# Altium schematic sheet G-103M-20190827.SchDoc
size A3
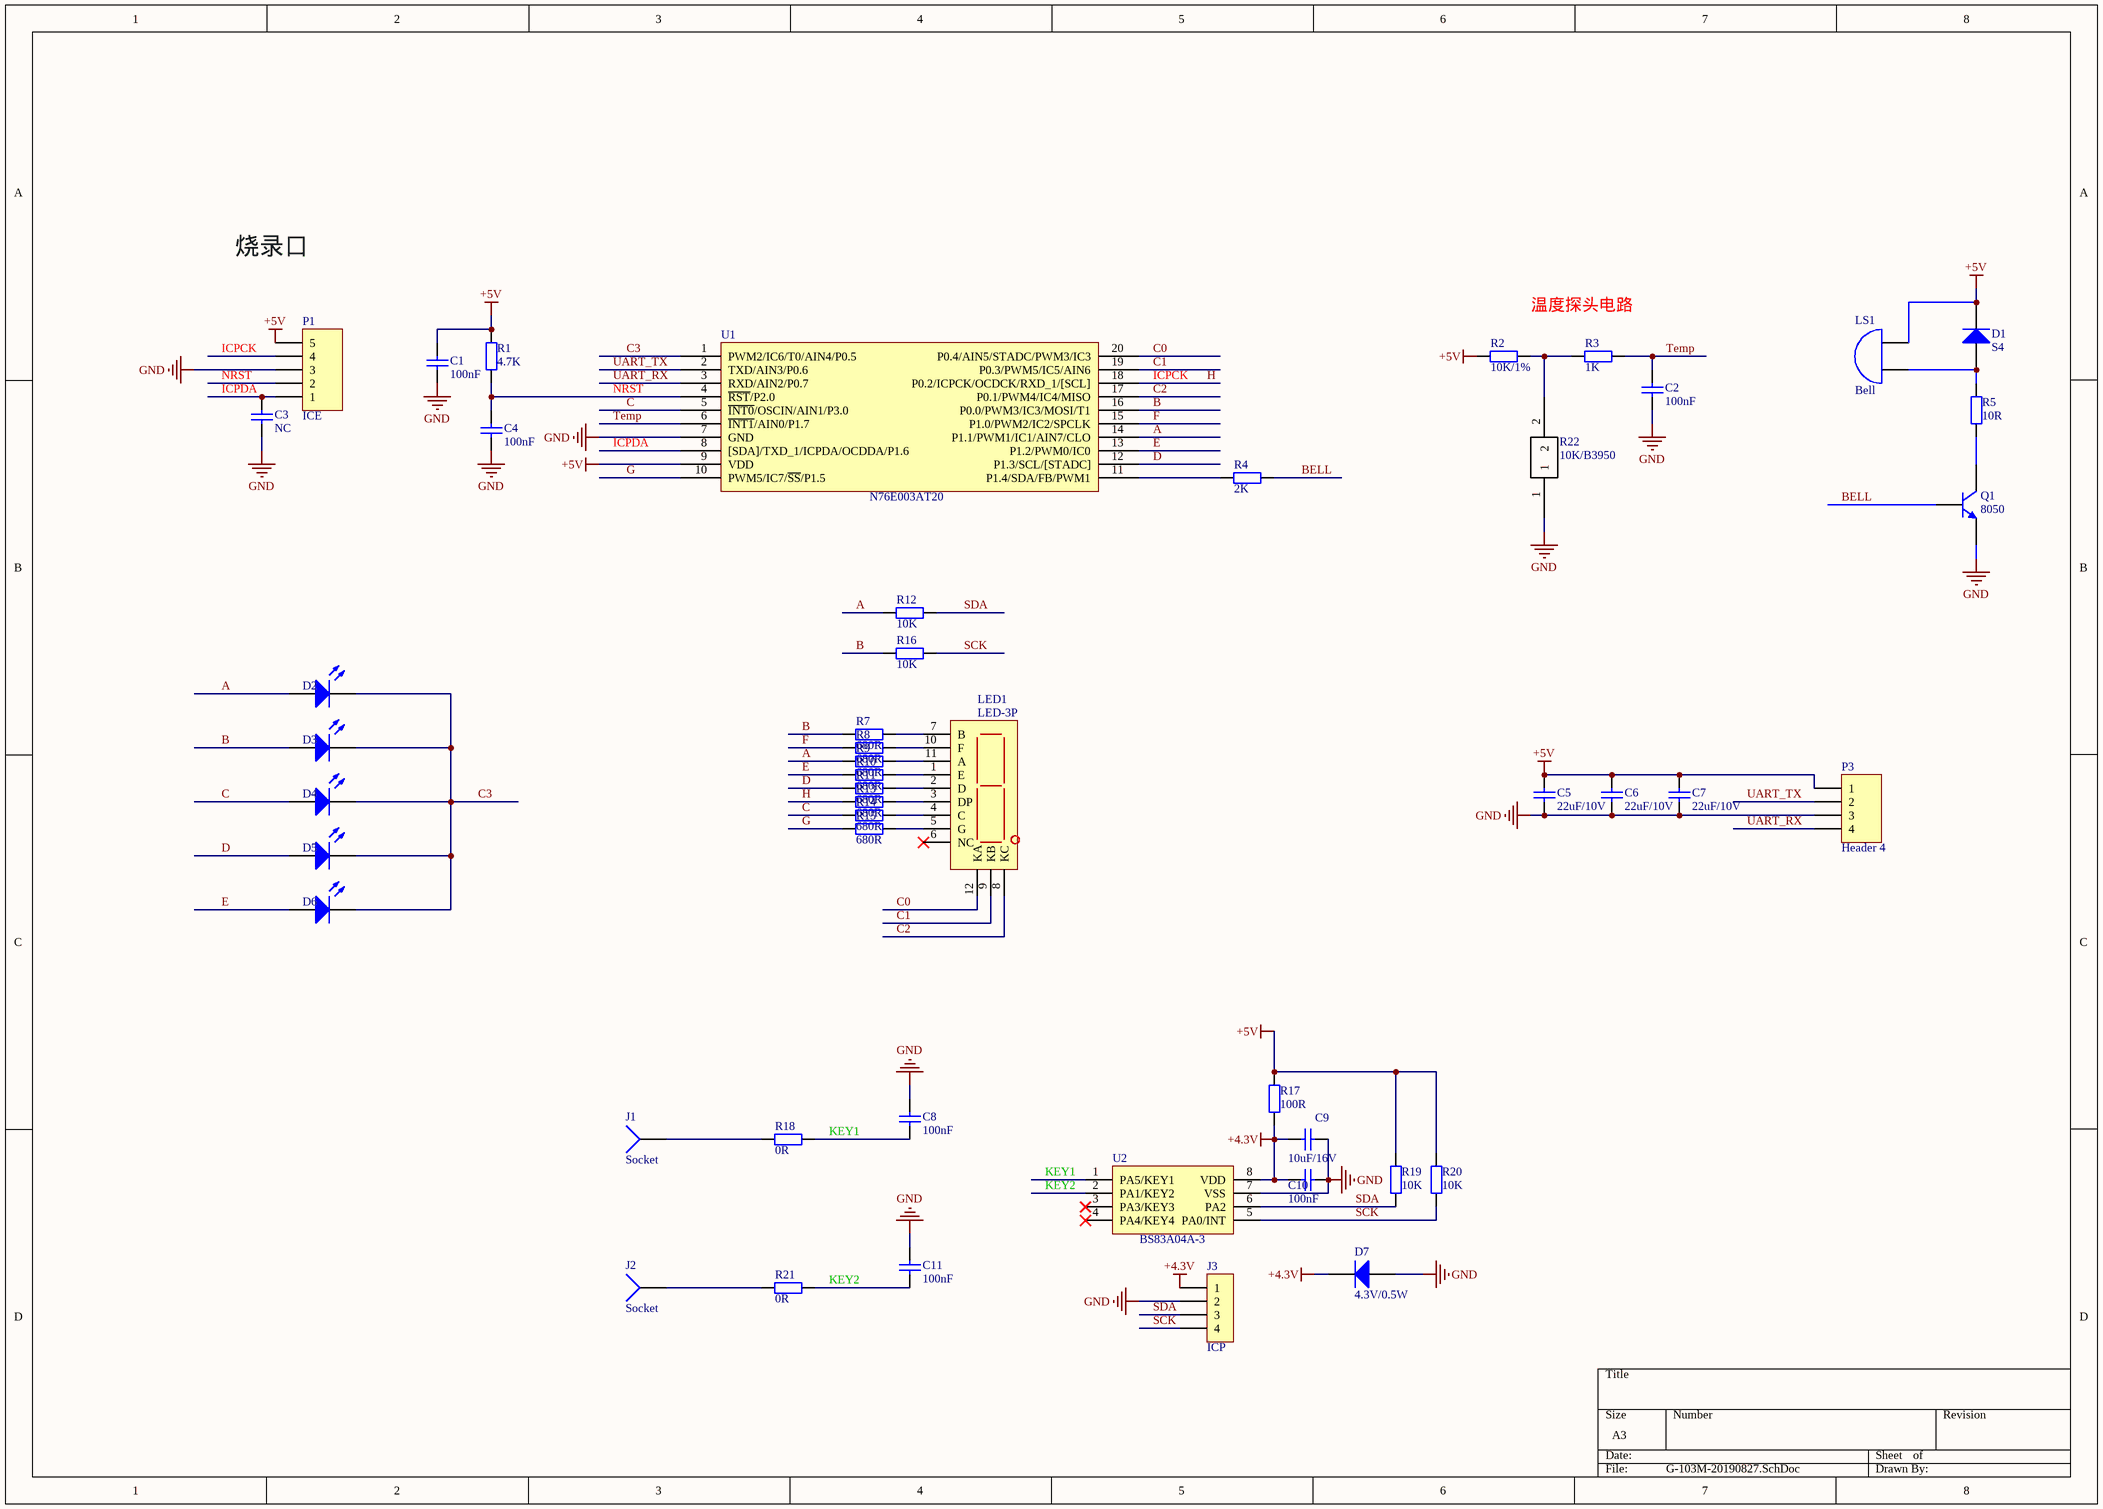
[diagram p0: G-103M-20190827.SchDoc]

## Parts
C1  value 100nF  [SMD-0603]  (hidden comment: Cap)
C2  100nF  [SMD-0603]
C3  NC  [SMD-0603]
C4  value 100nF  [SMD-0603]  (hidden comment: Cap)
C5  22uF/10V  [SMD-0603]
C6  22uF/10V  [SMD-0603]
C7  22uF/10V  [SMD-0603]
C8  100nF  [SMD-0603]
C9  10uF/16V  [SMD-0603]
C10  100nF  [SMD-0603]
C11  100nF  [SMD-0603]
D1  S4  [SOD123]
D2  (no value)  [LED-3MM]
D3  (no value)  [LED-3MM]
D4  (no value)  [LED-3MM]
D5  (no value)  [LED-3MM]
D6  (no value)  [LED-3MM]
D7  4.3V/0.5W  [SOD123]
J1  Socket  [KEY-C1]
J2  Socket  [KEY-C1]
J3  ICP  [HDR1X4]
LED1  LED-3P  [LED363]
LS1  Bell  [BUZ-2-5V]
P1  ICE  [HDR1X5]
P3  Header 4  [2.0-4P]
Q1  8050  [SOT-23E2]
R1  value 4.7K  [SMD-0603]  (hidden comment: Res2)
R2  10K/1%  [SMD-0603]
R3  1K  [SMD-0603]
R4  2K  [SMD-0603]
R5  10R  [SMD-0603]
R7  680R  [SMD-0603]
R8  680R  [SMD-0603]
R9  680R  [SMD-0603]
R10  680R  [SMD-0603]
R11  680R  [SMD-0603]
R12  10K  [SMD-0603]
R13  680R  [SMD-0603]
R14  680R  [SMD-0603]
R15  680R  [SMD-0603]
R16  10K  [SMD-0603]
R17  100R  [SMD-0603]
R18  0R  [SMD-0603]
R19  10K  [SMD-0603]
R20  10K  [SMD-0603]
R21  0R  [SMD-0603]
R22  10K/B3950  [SMD-0603]
U1  N76E003AT20  [TSSOP-20]
U2  BS83A04A-3  [SOP8]

## Nets
+4.3V: C9.1 C10.1 D7.2(K) J3.1 R17.2 U2.8(VDD)
+5V: C1.2 C5.2 C6.2 C7.2 D1.2(K) LS1.1(A) P1.5 P3.1 R1.1 R2.2 R17.1 R19.2 R20.2 U1.9(VDD)
GND: C1.1 C2.1 C3.2 C4.1 C5.1 C6.1 C7.1 C8.2 C9.2 C10.2 C11.2 D7.1(A) J3.2 P1.3 P3.3 Q1.E R22.1 U1.7(GND) U2.7(VSS)
A: D2.1(A) R9.2 R12.1 U1.14(P1.1/PWM1/IC1/AIN7/CLO)
B: D3.1(A) R7.2 R16.1 U1.16(P0.0/PWM3/IC3/MOSI/T1)
BELL: Q1.B R4.1
C: D4.1(A) R14.2 U1.5(~{INT0}/OSCIN/AIN1/P3.0)
C0: LED1.12(KA) U1.20(P0.4/AIN5/STADC/PWM3/IC3)
C1: LED1.9(KB) U1.19(P0.3/PWM5/IC5/AIN6)
C2: LED1.8(KC) U1.17(P0.1/PWM4/IC4/MISO)
C3: D2.2(K) D3.2(K) D4.2(K) D5.2(K) D6.2(K) U1.1(PWM2/IC6/T0/AIN4/P0.5)
D: D5.1(A) R11.2 U1.12(P1.3/SCL/[STADC])
E: D6.1(A) R10.2 U1.13(P1.2/PWM0/IC0)
F: R8.2 U1.15(P1.0/PWM2/IC2/SPCLK)
G: R15.2 U1.10(PWM5/IC7/~{SS}/P1.5)
H: P1.4 R13.2 U1.18(P0.2/ICPCK/OCDCK/RXD_1/[SCL])  [also labelled ICPCK]
ICPDA: C3.1 P1.1 U1.8([SDA]/TXD_1/ICPDA/OCDDA/P1.6)
KEY1: C8.1 R18.1 U2.1(PA5/KEY1)
KEY2: C11.1 R21.1 U2.2(PA1/KEY2)
NRST: C4.2 P1.2 R1.2 U1.4(~{RST}/P2.0)
SCK: J3.4 R16.2 R20.1 U2.5(PA0/INT)
SDA: J3.3 R12.2 R19.1 U2.6(PA2)
Temp: C2.2 R3.1 U1.6(~{INT1}/AIN0/P1.7)
UART_RX: P3.4 U1.3(RXD/AIN2/P0.7)
UART_TX: P3.2 U1.2(TXD/AIN3/P0.6)
NetD1_1: D1.1(A) LS1.2(B) R5.1
NetJ1_1: J1.1 R18.2
NetJ2_1: J2.1 R21.2
NetLED1_1: LED1.1(E) R10.1
NetLED1_2: LED1.2(D) R11.1
NetLED1_3: LED1.3(DP) R13.1
NetLED1_4: LED1.4(C) R14.1
NetLED1_5: LED1.5(G) R15.1
NetLED1_7: LED1.7(B) R7.1
NetLED1_10: LED1.10(F) R8.1
NetLED1_11: LED1.11(A) R9.1
NetQ1_C: Q1.C R5.2
NetR2_1: R2.1 R3.2 R22.2
NetR4_2: R4.2 U1.11(P1.4/SDA/FB/PWM1)

Not connected (* = marked no-connect by the designer): LED1 6(NC)*; U2 3(PA3/KEY3)* 4(PA4/KEY4)*

## Notes on the sheet
- 烧录口
- 温度探头电路

## Library data of the parts
C1-C7 = Cap: Capacitor; Published: 8-Jun-2000; LatestRevisionDate: 17-Jul-2002; LatestRevisionNote: Re-released for DXP Platform.; PackageReference: RAD-0.3; Publisher: Altium Limited
  C2: Value: 100nF
  C3: Value: NC
  C5-C7: Value: 22uF/10V
C8-C11 = Cap Semi: Capacitor (Semiconductor SIM Model); Published: 8-Jun-2000; LatestRevisionDate: 17-Jul-2002; LatestRevisionNote: Re-released for DXP Platform.; PackageReference: C1206; Publisher: Altium Limited
  C8 C10 C11: Value: 100nF
  C9: Value: 10uF/16V
D1 D7 = Diode 1N4007: 1 Amp General Purpose Rectifier; Published: 8-Jun-2000; LatestRevisionDate: 17-Jul-2002; LatestRevisionNote: Re-released for DXP Platform.; DatasheetVersion: 1998; PackageVersion: Aug-1999; PackageReference: DO-41; Publisher: Altium Limited; Code_JEDEC: DO-204-AL; ComponentLink1Description: Manufacturer Link; ComponentLink1URL: http://www.fairchildsemi.com/; ComponentLink2Description: Datasheet; ComponentLink2URL: http://www.fairchildsemi.com/ds/1N%2F1N4001.pdf
D2-D6 = LED1: Typical RED GaAs LED; Published: 8-Jun-2000; LatestRevisionDate: 08-Jul-2005; LatestRevisionNote: Mech Layer 1 removed.; PackageReference: LED-1; Publisher: Altium Limited
J3 = CON4: Connector
LED1 = LED-3P: LED
LS1 = Bell: Electrical Bell; Published: 24-Mar-1999; LatestRevisionDate: 17-Jul-2002; LatestRevisionNote: Re-released for DXP Platform.; PackageReference: PIN2; Publisher: Altium Limited
P1 = Header 5: Header, 5-Pin; LatestRevisionDate: 17-Jul-2002; LatestRevisionNote: Re-released for DXP Platform.; Publisher: Altium Limited
P3 = Header 4: Header, 4-Pin; LatestRevisionDate: 17-Jul-2002; LatestRevisionNote: Re-released for DXP Platform.; Publisher: Altium Limited
Q1 = 2N3904: NPN General Purpose Amplifier; Published: 8-Jun-2000; LatestRevisionDate: 15-Jan-2003; LatestRevisionNote: PCB Footprint 'BCY-W3/D4.7' replaced; DatasheetVersion: 1997; PackageVersion: Sep-1998; PackageReference: TO-92A; Publisher: Altium Limited; Code_JEDEC: TO-92A; ComponentLink1Description: Manufacturer Link; ComponentLink1URL: http://www.fairchildsemi.com/; ComponentLink2Description: Datasheet; ComponentLink2URL: http://www.fairchildsemi.com/ds/2N%2F2N3904.pdf
R1 R3 R12 R16 R17 R19 R20 = Res2: Resistor; Published: 8-Jun-2000; LatestRevisionDate: 17-Jul-2002; LatestRevisionNote: Re-released for DXP Platform.; PackageReference: AXIAL-0.4; Publisher: Altium Limited
  R3: Value: 1K
  R12 R16 R19 R20: Value: 10K
  R17: Value: 100R
R2 R4 R5 R7-R11 R13-R15 R18 R21 = Res2: Resistor; Value: 1K; Published: 8-Jun-2000; LatestRevisionDate: 17-Jul-2002; LatestRevisionNote: Re-released for DXP Platform.; PackageReference: AXIAL-0.4; Publisher: Altium Limited
J1 J2 = Socket: LatestRevisionDate: 17-Jul-2002; LatestRevisionNote: Re-released for DXP Platform.; Publisher: Altium Limited